# EAGLE design Protoboard MX4-7-9 (EAGLE 7.7.0)
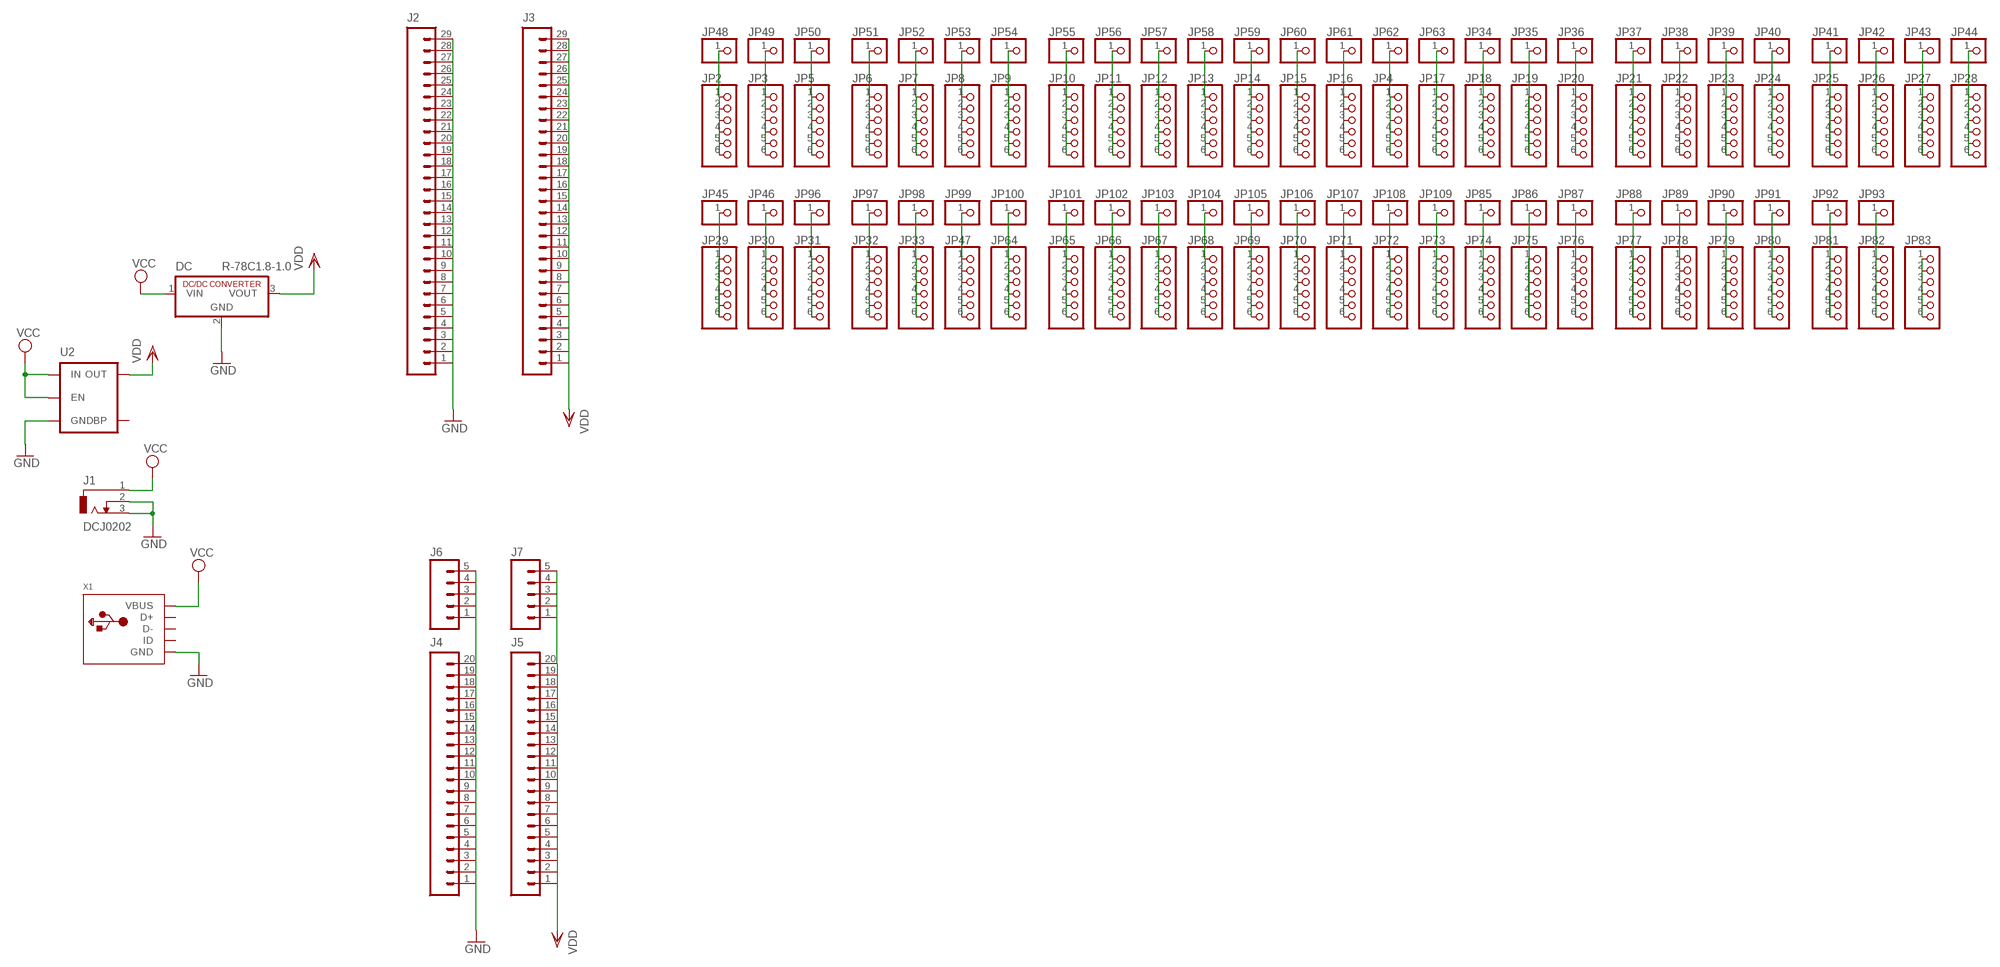
[diagram p0: schematic, sheet 1]

## Parts
DC  R-78C1.8-1.0  [SIP3]
J1  DCJ0202  [DCJ0202]
J2  M29NO_SILK  [1X29_NO_SILK]
J3  M29NO_SILK  [1X29_NO_SILK]
J4  M20NO_SILK_KIT  [1X20_NO_SILK_KIT]
J5  M20NO_SILK_KIT  [1X20_NO_SILK_KIT]
J6  M05NO_SILK  [1X05_NO_SILK]
J7  M05NO_SILK  [1X05_NO_SILK]
JP2  PINHD-1X6CB  [1X06-CLEANBIG]
JP3  PINHD-1X6CB  [1X06-CLEANBIG]
JP4  PINHD-1X6CB  [1X06-CLEANBIG]
JP5  PINHD-1X6CB  [1X06-CLEANBIG]
JP6  PINHD-1X6CB  [1X06-CLEANBIG]
JP7  PINHD-1X6CB  [1X06-CLEANBIG]
JP8  PINHD-1X6CB  [1X06-CLEANBIG]
JP9  PINHD-1X6CB  [1X06-CLEANBIG]
JP10  PINHD-1X6CB  [1X06-CLEANBIG]
JP11  PINHD-1X6CB  [1X06-CLEANBIG]
JP12  PINHD-1X6CB  [1X06-CLEANBIG]
JP13  PINHD-1X6CB  [1X06-CLEANBIG]
JP14  PINHD-1X6CB  [1X06-CLEANBIG]
JP15  PINHD-1X6CB  [1X06-CLEANBIG]
JP16  PINHD-1X6CB  [1X06-CLEANBIG]
JP17  PINHD-1X6CB  [1X06-CLEANBIG]
JP18  PINHD-1X6CB  [1X06-CLEANBIG]
JP19  PINHD-1X6CB  [1X06-CLEANBIG]
JP20  PINHD-1X6CB  [1X06-CLEANBIG]
JP21  PINHD-1X6CB  [1X06-CLEANBIG]
JP22  PINHD-1X6CB  [1X06-CLEANBIG]
JP23  PINHD-1X6CB  [1X06-CLEANBIG]
JP24  PINHD-1X6CB  [1X06-CLEANBIG]
JP25  PINHD-1X6CB  [1X06-CLEANBIG]
JP26  PINHD-1X6CB  [1X06-CLEANBIG]
JP27  PINHD-1X6CB  [1X06-CLEANBIG]
JP28  PINHD-1X6CB  [1X06-CLEANBIG]
JP29  PINHD-1X6CB  [1X06-CLEANBIG]
JP30  PINHD-1X6CB  [1X06-CLEANBIG]
JP31  PINHD-1X6CB  [1X06-CLEANBIG]
JP32  PINHD-1X6CB  [1X06-CLEANBIG]
JP33  PINHD-1X6CB  [1X06-CLEANBIG]
JP34  PINHD-1X1CB  [1X01-CLEANBIG]
JP35  PINHD-1X1CB  [1X01-CLEANBIG]
JP36  PINHD-1X1CB  [1X01-CLEANBIG]
JP37  PINHD-1X1CB  [1X01-CLEANBIG]
JP38  PINHD-1X1CB  [1X01-CLEANBIG]
JP39  PINHD-1X1CB  [1X01-CLEANBIG]
JP40  PINHD-1X1CB  [1X01-CLEANBIG]
JP41  PINHD-1X1CB  [1X01-CLEANBIG]
JP42  PINHD-1X1CB  [1X01-CLEANBIG]
JP43  PINHD-1X1CB  [1X01-CLEANBIG]
JP44  PINHD-1X1CB  [1X01-CLEANBIG]
JP45  PINHD-1X1CB  [1X01-CLEANBIG]
JP46  PINHD-1X1CB  [1X01-CLEANBIG]
JP47  PINHD-1X6CB  [1X06-CLEANBIG]
JP48  PINHD-1X1CB  [1X01-CLEANBIG]
JP49  PINHD-1X1CB  [1X01-CLEANBIG]
JP50  PINHD-1X1CB  [1X01-CLEANBIG]
JP51  PINHD-1X1CB  [1X01-CLEANBIG]
JP52  PINHD-1X1CB  [1X01-CLEANBIG]
JP53  PINHD-1X1CB  [1X01-CLEANBIG]
JP54  PINHD-1X1CB  [1X01-CLEANBIG]
JP55  PINHD-1X1CB  [1X01-CLEANBIG]
JP56  PINHD-1X1CB  [1X01-CLEANBIG]
JP57  PINHD-1X1CB  [1X01-CLEANBIG]
JP58  PINHD-1X1CB  [1X01-CLEANBIG]
JP59  PINHD-1X1CB  [1X01-CLEANBIG]
JP60  PINHD-1X1CB  [1X01-CLEANBIG]
JP61  PINHD-1X1CB  [1X01-CLEANBIG]
JP62  PINHD-1X1CB  [1X01-CLEANBIG]
JP63  PINHD-1X1CB  [1X01-CLEANBIG]
JP64  PINHD-1X6CB  [1X06-CLEANBIG]
JP65  PINHD-1X6CB  [1X06-CLEANBIG]
JP66  PINHD-1X6CB  [1X06-CLEANBIG]
JP67  PINHD-1X6CB  [1X06-CLEANBIG]
JP68  PINHD-1X6CB  [1X06-CLEANBIG]
JP69  PINHD-1X6CB  [1X06-CLEANBIG]
JP70  PINHD-1X6CB  [1X06-CLEANBIG]
JP71  PINHD-1X6CB  [1X06-CLEANBIG]
JP72  PINHD-1X6CB  [1X06-CLEANBIG]
JP73  PINHD-1X6CB  [1X06-CLEANBIG]
JP74  PINHD-1X6CB  [1X06-CLEANBIG]
JP75  PINHD-1X6CB  [1X06-CLEANBIG]
JP76  PINHD-1X6CB  [1X06-CLEANBIG]
JP77  PINHD-1X6CB  [1X06-CLEANBIG]
JP78  PINHD-1X6CB  [1X06-CLEANBIG]
JP79  PINHD-1X6CB  [1X06-CLEANBIG]
JP80  PINHD-1X6CB  [1X06-CLEANBIG]
JP81  PINHD-1X6CB  [1X06-CLEANBIG]
JP82  PINHD-1X6CB  [1X06-CLEANBIG]
JP83  PINHD-1X6CB  [1X06-CLEANBIG]
JP85  PINHD-1X1CB  [1X01-CLEANBIG]
JP86  PINHD-1X1CB  [1X01-CLEANBIG]
JP87  PINHD-1X1CB  [1X01-CLEANBIG]
JP88  PINHD-1X1CB  [1X01-CLEANBIG]
JP89  PINHD-1X1CB  [1X01-CLEANBIG]
JP90  PINHD-1X1CB  [1X01-CLEANBIG]
JP91  PINHD-1X1CB  [1X01-CLEANBIG]
JP92  PINHD-1X1CB  [1X01-CLEANBIG]
JP93  PINHD-1X1CB  [1X01-CLEANBIG]
JP96  PINHD-1X1CB  [1X01-CLEANBIG]
JP97  PINHD-1X1CB  [1X01-CLEANBIG]
JP98  PINHD-1X1CB  [1X01-CLEANBIG]
JP99  PINHD-1X1CB  [1X01-CLEANBIG]
JP100  PINHD-1X1CB  [1X01-CLEANBIG]
JP101  PINHD-1X1CB  [1X01-CLEANBIG]
JP102  PINHD-1X1CB  [1X01-CLEANBIG]
JP103  PINHD-1X1CB  [1X01-CLEANBIG]
JP104  PINHD-1X1CB  [1X01-CLEANBIG]
JP105  PINHD-1X1CB  [1X01-CLEANBIG]
JP106  PINHD-1X1CB  [1X01-CLEANBIG]
JP107  PINHD-1X1CB  [1X01-CLEANBIG]
JP108  PINHD-1X1CB  [1X01-CLEANBIG]
JP109  PINHD-1X1CB  [1X01-CLEANBIG]
U2  MIC52053.3V  [SOT23-5]
X1  USBMICRO_20329  [4UCONN_20329]

## Nets
GND: DC.2(GND) J1.2 J1.3 J2.1 J2.2 J2.3 J2.4 J2.5 J2.6 J2.7 J2.8 J2.9 J2.10 J2.11 J2.12 J2.13 J2.14 J2.15 J2.16 J2.17 J2.18 J2.19 J2.20 J2.21 J2.22 J2.23 J2.24 J2.25 J2.26 J2.27 J2.28 J2.29 J4.1 J4.2 J4.3 J4.4 J4.5 J4.6 J4.7 J4.8 J4.9 J4.10 J4.11 J4.12 J4.13 J4.14 J4.15 J4.16 J4.17 J4.18 J4.19 J4.20 J6.1 J6.2 J6.3 J6.4 J6.5 U2.2(GND) X1.BASE@1(GND) X1.BASE@2(GND) X1.GND X1.SPRT@1(GND) X1.SPRT@2(GND) X1.SPRT@3(GND) X1.SPRT@4(GND)
N$1: JP2.1 JP2.2 JP2.3 JP2.4 JP2.5 JP2.6 JP48.1
N$2: JP31.1 JP31.2 JP31.3 JP31.4 JP31.5 JP31.6 JP96.1
N$3: JP32.1 JP32.2 JP32.3 JP32.4 JP32.5 JP32.6 JP97.1
N$4: JP33.1 JP33.2 JP33.3 JP33.4 JP33.5 JP33.6 JP98.1
N$5: JP3.1 JP3.2 JP3.3 JP3.4 JP3.5 JP3.6 JP49.1
N$6: JP5.1 JP5.2 JP5.3 JP5.4 JP5.5 JP5.6 JP50.1
N$7: JP6.1 JP6.2 JP6.3 JP6.4 JP6.5 JP6.6 JP51.1
N$8: JP7.1 JP7.2 JP7.3 JP7.4 JP7.5 JP7.6 JP52.1
N$9: JP8.1 JP8.2 JP8.3 JP8.4 JP8.5 JP8.6 JP53.1
N$10: JP9.1 JP9.2 JP9.3 JP9.4 JP9.5 JP9.6 JP54.1
N$11: JP10.1 JP10.2 JP10.3 JP10.4 JP10.5 JP10.6 JP55.1
N$12: JP11.1 JP11.2 JP11.3 JP11.4 JP11.5 JP11.6 JP56.1
N$13: JP12.1 JP12.2 JP12.3 JP12.4 JP12.5 JP12.6 JP57.1
N$14: JP13.1 JP13.2 JP13.3 JP13.4 JP13.5 JP13.6 JP58.1
N$15: JP14.1 JP14.2 JP14.3 JP14.4 JP14.5 JP14.6 JP59.1
N$16: JP15.1 JP15.2 JP15.3 JP15.4 JP15.5 JP15.6 JP60.1
N$17: JP16.1 JP16.2 JP16.3 JP16.4 JP16.5 JP16.6 JP61.1
N$18: JP4.1 JP4.2 JP4.3 JP4.4 JP4.5 JP4.6 JP62.1
N$19: JP17.1 JP17.2 JP17.3 JP17.4 JP17.5 JP17.6 JP63.1
N$20: JP18.1 JP18.2 JP18.3 JP18.4 JP18.5 JP18.6 JP34.1
N$21: JP19.1 JP19.2 JP19.3 JP19.4 JP19.5 JP19.6 JP35.1
N$22: JP20.1 JP20.2 JP20.3 JP20.4 JP20.5 JP20.6 JP36.1
N$23: JP47.1 JP47.2 JP47.3 JP47.4 JP47.5 JP47.6 JP99.1
N$24: JP64.1 JP64.2 JP64.3 JP64.4 JP64.5 JP64.6 JP100.1
N$26: JP65.1 JP65.2 JP65.3 JP65.4 JP65.5 JP65.6 JP101.1
N$27: JP21.1 JP21.2 JP21.3 JP21.4 JP21.5 JP21.6 JP37.1
N$28: JP22.1 JP22.2 JP22.3 JP22.4 JP22.5 JP22.6 JP38.1
N$29: JP23.1 JP23.2 JP23.3 JP23.4 JP23.5 JP23.6 JP39.1
N$30: JP24.1 JP24.2 JP24.3 JP24.4 JP24.5 JP24.6 JP40.1
N$31: JP25.1 JP25.2 JP25.3 JP25.4 JP25.5 JP25.6 JP41.1
N$32: JP26.1 JP26.2 JP26.3 JP26.4 JP26.5 JP26.6 JP42.1
N$33: JP27.1 JP27.2 JP27.3 JP27.4 JP27.5 JP27.6 JP43.1
N$34: JP66.1 JP66.2 JP66.3 JP66.4 JP66.5 JP66.6 JP102.1
N$35: JP28.1 JP28.2 JP28.3 JP28.4 JP28.5 JP28.6 JP44.1
N$36: JP29.1 JP29.2 JP29.3 JP29.4 JP29.5 JP29.6 JP45.1
N$37: JP30.1 JP30.2 JP30.3 JP30.4 JP30.5 JP30.6 JP46.1
N$38: JP67.1 JP67.2 JP67.3 JP67.4 JP67.5 JP67.6 JP103.1
N$39: JP68.1 JP68.2 JP68.3 JP68.4 JP68.5 JP68.6 JP104.1
N$41: JP69.1 JP69.2 JP69.3 JP69.4 JP69.5 JP69.6 JP105.1
N$46: JP70.1 JP70.2 JP70.3 JP70.4 JP70.5 JP70.6 JP106.1
N$47: JP71.1 JP71.2 JP71.3 JP71.4 JP71.5 JP71.6 JP107.1
N$48: JP72.1 JP72.2 JP72.3 JP72.4 JP72.5 JP72.6 JP108.1
N$49: JP73.1 JP73.2 JP73.3 JP73.4 JP73.5 JP73.6 JP109.1
N$50: JP74.1 JP74.2 JP74.3 JP74.4 JP74.5 JP74.6 JP85.1
N$51: JP75.1 JP75.2 JP75.3 JP75.4 JP75.5 JP75.6 JP86.1
N$52: JP76.1 JP76.2 JP76.3 JP76.4 JP76.5 JP76.6 JP87.1
N$53: JP77.1 JP77.2 JP77.3 JP77.4 JP77.5 JP77.6 JP88.1
N$54: JP78.1 JP78.2 JP78.3 JP78.4 JP78.5 JP78.6 JP89.1
N$55: JP79.1 JP79.2 JP79.3 JP79.4 JP79.5 JP79.6 JP90.1
N$56: JP80.1 JP80.2 JP80.3 JP80.4 JP80.5 JP80.6 JP91.1
N$57: JP81.1 JP81.2 JP81.3 JP81.4 JP81.5 JP81.6 JP92.1
N$58: JP82.1 JP82.2 JP82.3 JP82.4 JP82.5 JP82.6 JP93.1
N$59: JP83.1 JP83.2 JP83.3 JP83.4 JP83.5 JP83.6
VCC: DC.1(VIN) J1.1 U2.1(IN) U2.3(EN) X1.VBUS
VDD: DC.3(VOUT) J3.1 J3.2 J3.3 J3.4 J3.5 J3.6 J3.7 J3.8 J3.9 J3.10 J3.11 J3.12 J3.13 J3.14 J3.15 J3.16 J3.17 J3.18 J3.19 J3.20 J3.21 J3.22 J3.23 J3.24 J3.25 J3.26 J3.27 J3.28 J3.29 J5.1 J5.2 J5.3 J5.4 J5.5 J5.6 J5.7 J5.8 J5.9 J5.10 J5.11 J5.12 J5.13 J5.14 J5.15 J5.16 J5.17 J5.18 J5.19 J5.20 J7.1 J7.2 J7.3 J7.4 J7.5 U2.5(OUT)
Unconnected: U2.4(BP) X1.D+ X1.D- X1.ID

## Library data of the parts
DC = dc-dc-converter:R-78C*-1.0: INNOLINE DC/DC-Converter 1.0 AMP SIP3 Single Output Source: Data sheet <http://www.mikrocontroller.net/attachment/150645/157764-da-01-en-DC_DC_WANDLER_R_78C5_0_1_0.pdf>
J1 = con-jack:DCJ0202: DC POWER JACK Source: DCJ0202.pdf; OC_FARNELL: unknown; OC_NEWARK: unknown
J2 J3 = SparkFun-Connectors:M29: 1x29 .1" header
J4 J5 = SparkFun-Connectors:M20: 1x20 .1" header This is just like the LOCK variant in that the holes are staggared by 5 mil, but except for the last two holes. They are not altered from the "standard" footprint layout. This is used for a special purpose on the layout of our Graphic LCD Backpack. Make sure you want to use this device before selecting it for you project!
J6 J7 = SparkFun-Connectors:M05: Header 5 Standard 5-pin 0.1" header. Use with straight break away headers (SKU : PRT-00116), right angle break away headers (PRT-00553), swiss pins (PRT-00743), machine pins (PRT-00117), and female headers (PRT-00115). Molex polarized connector foot print use with SKU : PRT-08230 with associated crimp pins and housings.
JP2-JP33 JP47 JP64-JP83 = adafruit:PINHD-1X6: PIN HEADER
JP34-JP46 JP48-JP63 JP85-JP93 JP96-JP109 = adafruit:PINHD-1X1: Pin header 1x1 for 0.1" spacing With round pins
U2 = SparkFun-PowerIC:MIC5205: MIC5205 150mA vreg 3.3V - VREG-00822 5V - VREG-00823; PROD_ID: VREG-00822
X1 = microbuilder:USB: USB Connectors USBMINIB - Surface Mount Female Mini-B USB Connector 4UConnector: 06564

## Net classes
0 default: width 0.508 mm, drill 0.508 mm, clearance 0.127 mm

## Board
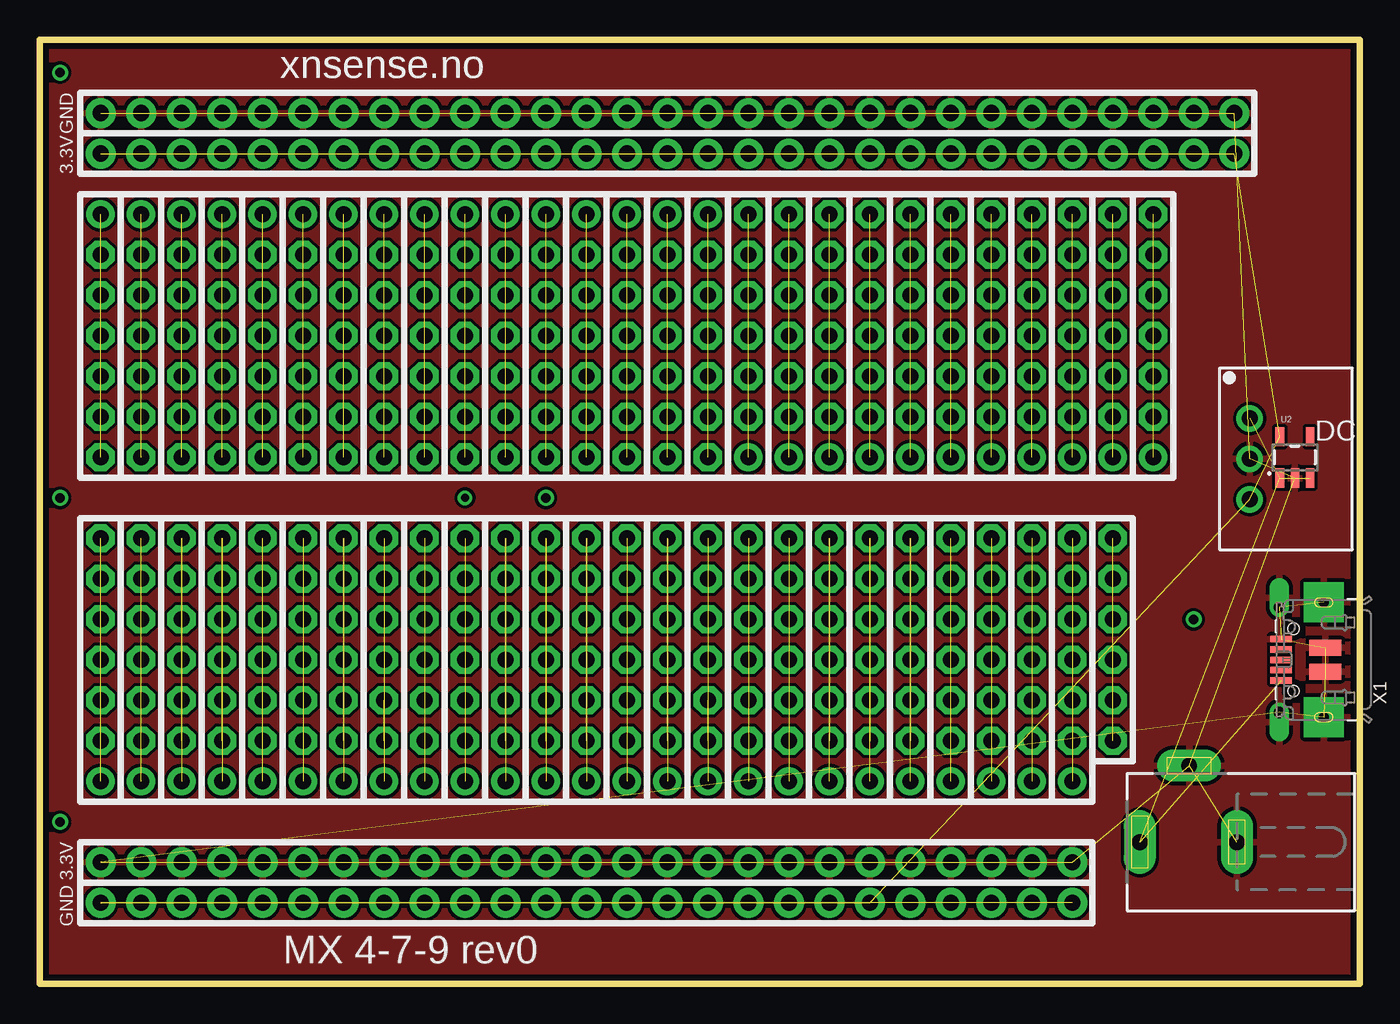
[diagram p1: board, top side]
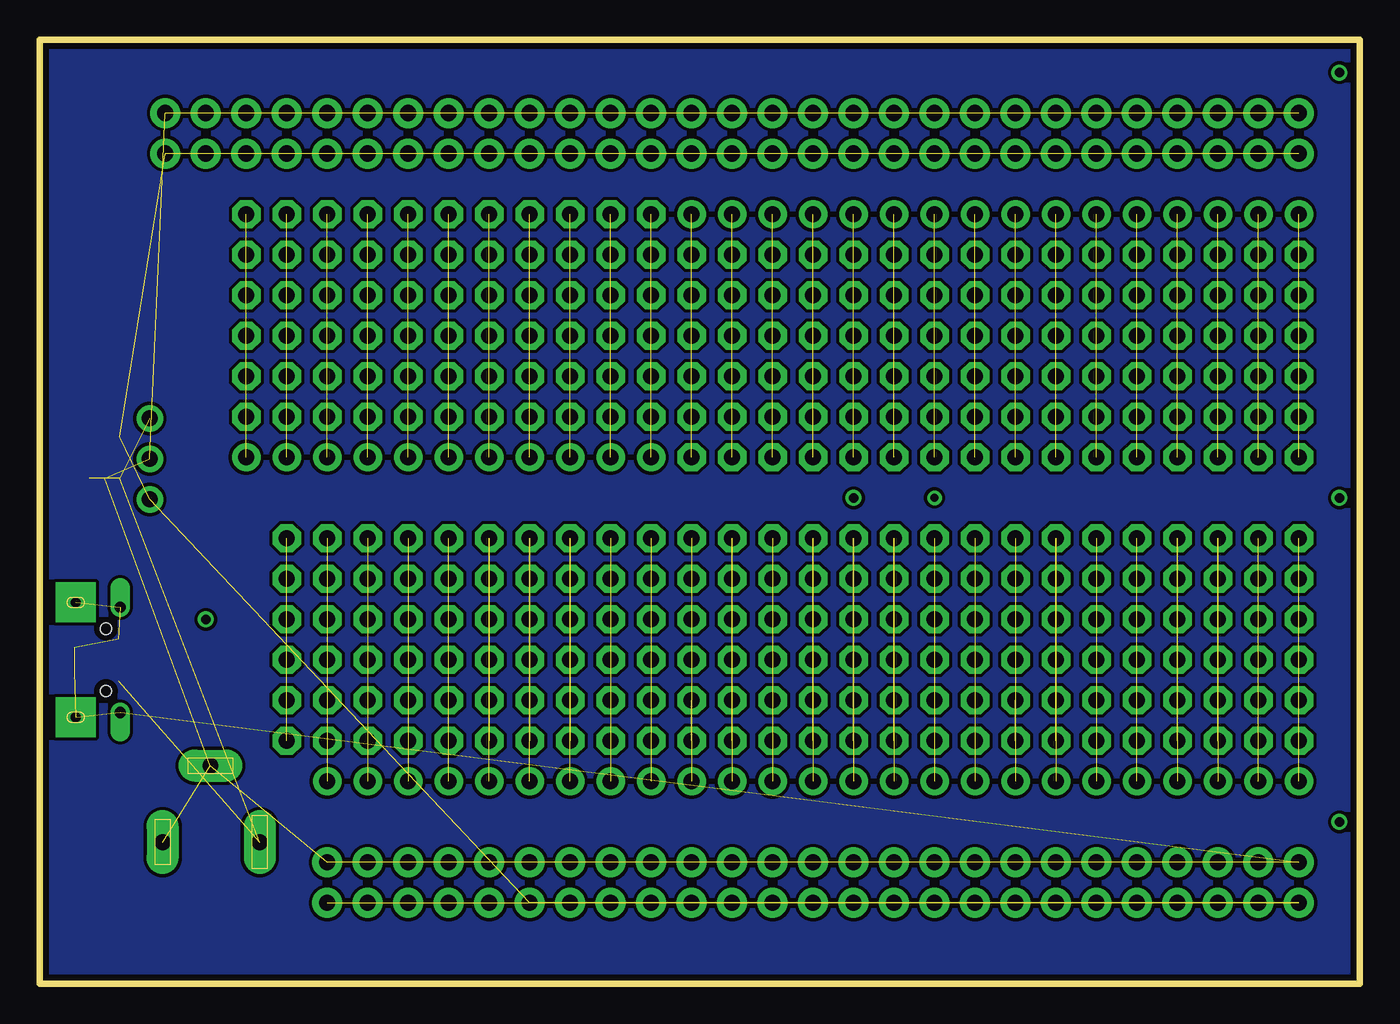
[diagram p2: board, bottom side, seen from below]

Size 82.8 x 59.2 mm. Coordinates in mm from the lower left corner, seen from the top.
Outline: 0,0 0,59.2 82.8,59.2 82.8,0 0,0
Copper layers (1*16): Top 0.035mm / dielectric 1.5mm / Bottom 0.035mm
Design rules "default *": minimum track width 10mil, minimum drill 20mil, track to track 8mil, track to pad 8mil, pad to pad 8mil, via to via 8mil, smd to smd 8mil, copper to edge 15mil, drill to drill 8mil, minimum pad ring 10mil, minimum via ring 8mil, stop-mask expansion 4mil, vias tented up to drill 0mil, thermal gap 10mil

### Footprints (pad centres in the part's own frame; a part is rotated, then mirrored left to right if it is on the bottom)
SIP3 = drill 1 pad 1.676: 1 -2.54,0; 2 0,0; 3 2.54,0
DCJ0202 = drill 1 pad 2 long: 1 0,3.1; 2 4.8,0; 3 0,-3
1X29_NO_SILK = drill 1.016 pad 1.88: 1 0,0; 2 2.54,0; 3 5.08,0; 4 7.62,0; 5 10.16,0; 6 12.7,0; 7 15.24,0; 8 17.78,0; 9 20.32,0; 10 22.86,0; 11 25.4,0; 12 27.94,0; 13 30.48,0; 14 33.02,0; 15 35.56,0; 16 38.1,0; 17 40.64,0; 18 43.18,0; 19 45.72,0; 20 48.26,0; 21 50.8,0; 22 53.34,0; 23 55.88,0; 24 58.42,0; 25 60.96,0; 26 63.5,0; 27 66.04,0; 28 68.58,0; 29 71.12,0
1X20_NO_SILK_KIT = drill 1.016 pad 1.88: 1 0,0; 2 2.54,0; 3 5.08,0; 4 7.62,0; 5 10.16,0; 6 12.7,0; 7 15.24,0; 8 17.78,0; 9 20.32,0; 10 22.86,0; 11 25.4,0; 12 27.94,0; 13 30.48,0; 14 33.02,0; 15 35.56,0; 16 38.1,0; 17 40.64,0; 18 43.18,0; 19 45.72,0; 20 48.26,0
1X05_NO_SILK = drill 1.016 pad 1.88: 1 0,0; 2 2.54,0; 3 5.08,0; 4 7.62,0; 5 10.16,0
1X06-CLEANBIG = drill 1.016 pad 1.778 octagon: 1 -6.35,0; 2 -3.81,0; 3 -1.27,0; 4 1.27,0; 5 3.81,0; 6 6.35,0
1X01-CLEANBIG = drill 1.016 pad 1.778: 1 0,0
SOT23-5 = smd 0.55 x 1.2: 1 -0.95,-1.3; 2 0,-1.3; 3 0.95,-1.3; 4 0.95,1.3; 5 -0.95,1.3
4UCONN_20329 = smd 1 x 2: BASE@1 -0.75,-2; BASE@2 0.75,-2 | smd 0.4 x 1.35: D+ 0,0.775; D- -0.65,0.775; GND 1.3,0.775; ID 0.65,0.775; VBUS -1.3,0.775 | drill 0.7 offset: SPRT@1 -3.3,0.9; SPRT@2 3.3,0.9 | drill 0.6 pad 2.5 square: SPRT@3 -3.6,-1.9; SPRT@4 3.6,-1.9 | hole 0.7: -1.95,0; 1.95,0

### Placement (x,y rotation side)
DC  75.9,32.92 270 top
J1  72.1,8.89 90 top
J2  3.81,54.61 0 top
J3  3.81,52.07 0 top
J4  3.81,7.62 0 top
J5  3.81,5.08 0 top
J6  54.61,7.62 0 top
J7  54.61,5.08 0 top
JP2  3.81,39.37 90 top
JP3  6.35,39.37 90 top
JP4  8.89,39.37 90 top
JP5  11.43,39.37 90 top
JP6  13.97,39.37 90 top
JP7  16.51,39.37 90 top
JP8  19.05,39.37 90 top
JP9  21.59,39.37 90 top
JP10  24.13,39.37 90 top
JP11  26.67,39.37 90 top
JP12  29.21,39.37 90 top
JP13  31.75,39.37 90 top
JP14  34.29,39.37 90 top
JP15  36.83,39.37 90 top
JP16  39.37,39.37 90 top
JP17  41.91,39.37 90 top
JP18  44.45,41.91 90 top
JP19  46.99,41.91 90 top
JP20  49.53,41.91 90 top
JP21  52.07,41.91 90 top
JP22  54.61,41.91 90 top
JP23  57.15,41.91 90 top
JP24  59.69,41.91 90 top
JP25  62.23,41.91 90 top
JP26  64.77,41.91 90 top
JP27  67.31,41.91 90 top
JP28  69.85,41.91 90 top
JP29  6.35,21.59 90 top
JP30  3.81,21.59 90 top
JP31  8.89,21.59 90 top
JP32  11.43,21.59 90 top
JP33  13.97,21.59 90 top
JP34  44.45,33.02 0 top
JP35  46.99,33.02 0 top
JP36  49.53,33.02 0 top
JP37  52.07,33.02 0 top
JP38  54.61,33.02 0 top
JP39  57.15,33.02 0 top
JP40  59.69,33.02 0 top
JP41  62.23,33.02 0 top
JP42  64.77,33.02 0 top
JP43  67.31,33.02 0 top
JP44  69.85,33.02 0 top
JP45  6.35,12.7 0 top
JP46  3.81,12.7 0 top
JP47  16.51,21.59 90 top
JP48  3.81,48.26 0 top
JP49  6.35,48.26 0 top
JP50  11.43,48.26 0 top
JP51  13.97,48.26 0 top
JP52  16.51,48.26 0 top
JP53  19.05,48.26 0 top
JP54  21.59,48.26 0 top
JP55  24.13,48.26 0 top
JP56  26.67,48.26 0 top
JP57  29.21,48.26 0 top
JP58  31.75,48.26 0 top
JP59  34.29,48.26 0 top
JP60  36.83,48.26 0 top
JP61  39.37,48.26 0 top
JP62  8.89,48.26 0 top
JP63  41.91,48.26 0 top
JP64  19.05,21.59 90 top
JP65  21.59,21.59 90 top
JP66  24.13,21.59 90 top
JP67  26.67,21.59 90 top
JP68  29.21,21.59 90 top
JP69  31.75,21.59 90 top
JP70  34.29,21.59 90 top
JP71  36.83,21.59 90 top
JP72  39.37,21.59 90 top
JP73  41.91,21.59 90 top
JP74  44.45,21.59 90 top
JP75  46.99,21.59 90 top
JP76  49.53,21.59 90 top
JP77  52.07,21.59 90 top
JP78  54.61,21.59 90 top
JP79  57.15,21.59 90 top
JP80  59.69,21.59 90 top
JP81  62.23,21.59 90 top
JP82  64.77,21.59 90 top
JP83  67.31,21.59 90 top
JP85  44.45,12.7 0 top
JP86  46.99,12.7 0 top
JP87  49.53,12.7 0 top
JP88  52.07,12.7 0 top
JP89  54.61,12.7 0 top
JP90  57.15,12.7 0 top
JP91  59.69,12.7 0 top
JP92  62.23,12.7 0 top
JP93  64.77,12.7 0 top
JP96  8.89,12.7 0 top
JP97  11.43,12.7 0 top
JP98  13.97,12.7 0 top
JP99  16.51,12.7 0 top
JP100  19.05,12.7 0 top
JP101  21.59,12.7 0 top
JP102  24.13,12.7 0 top
JP103  26.67,12.7 0 top
JP104  29.21,12.7 0 top
JP105  31.75,12.7 0 top
JP106  34.29,12.7 0 top
JP107  36.83,12.7 0 top
JP108  39.37,12.7 0 top
JP109  41.91,12.7 0 top
U2  78.74,33.02 0 top
X1  78.65,20.32 90 top

### Tracks (layer width: path | path; a pad name or v marks a point on that pad's centre or on a via)
GND  (64 unrouted)
  pour Top: 0,59.2 0,0 82.8,0 82.8,59.2
N$1  (6 unrouted)
N$2  (6 unrouted)
N$3  (6 unrouted)
N$4  (6 unrouted)
N$5  (6 unrouted)
N$6  (6 unrouted)
N$7  (6 unrouted)
N$8  (6 unrouted)
N$9  (6 unrouted)
N$10  (6 unrouted)
N$11  (6 unrouted)
N$12  (6 unrouted)
N$13  (6 unrouted)
N$14  (6 unrouted)
N$15  (6 unrouted)
N$16  (6 unrouted)
N$17  (6 unrouted)
N$18  (6 unrouted)
N$19  (6 unrouted)
N$20  (6 unrouted)
N$21  (6 unrouted)
N$22  (6 unrouted)
N$23  (6 unrouted)
N$24  (6 unrouted)
N$25  (via drill 0.6)
  other vias: 31.75,30.48 72.39,22.86
N$26  (6 unrouted)
N$27  (6 unrouted)
N$28  (6 unrouted)
N$29  (6 unrouted)
N$30  (6 unrouted)
N$31  (6 unrouted)
N$32  (6 unrouted)
N$33  (6 unrouted)
N$34  (6 unrouted)
N$35  (6 unrouted)
N$36  (6 unrouted)
N$37  (6 unrouted)
N$38  (6 unrouted)
N$39  (6 unrouted)
N$40  (via drill 0.51)
  other vias: 26.67,30.48
N$41  (6 unrouted)
N$42  (via drill 0.6)
  other vias: 1.27,10.16
N$43  (via drill 0.6)
  other vias: 1.27,30.48
N$44  (via drill 0.6)
  other vias: 1.27,57.15
N$45
  pour Bottom: 0,59.2 82.8,59.2 82.8,0 0,0
N$46  (6 unrouted)
N$47  (6 unrouted)
N$48  (6 unrouted)
N$49  (6 unrouted)
N$50  (6 unrouted)
N$51  (6 unrouted)
N$52  (6 unrouted)
N$53  (6 unrouted)
N$54  (6 unrouted)
N$55  (6 unrouted)
N$56  (6 unrouted)
N$57  (6 unrouted)
N$58  (6 unrouted)
N$59  (5 unrouted)
VCC  (4 unrouted)
VDD  (55 unrouted)

### Text on the board
tNames: xnsense.no | GND | 3.3V | 3.3V | GND | MX 4-7-9 rev0